# EAGLE schematic SysnapseWriless-BOB-v11g (EAGLE 5.11)
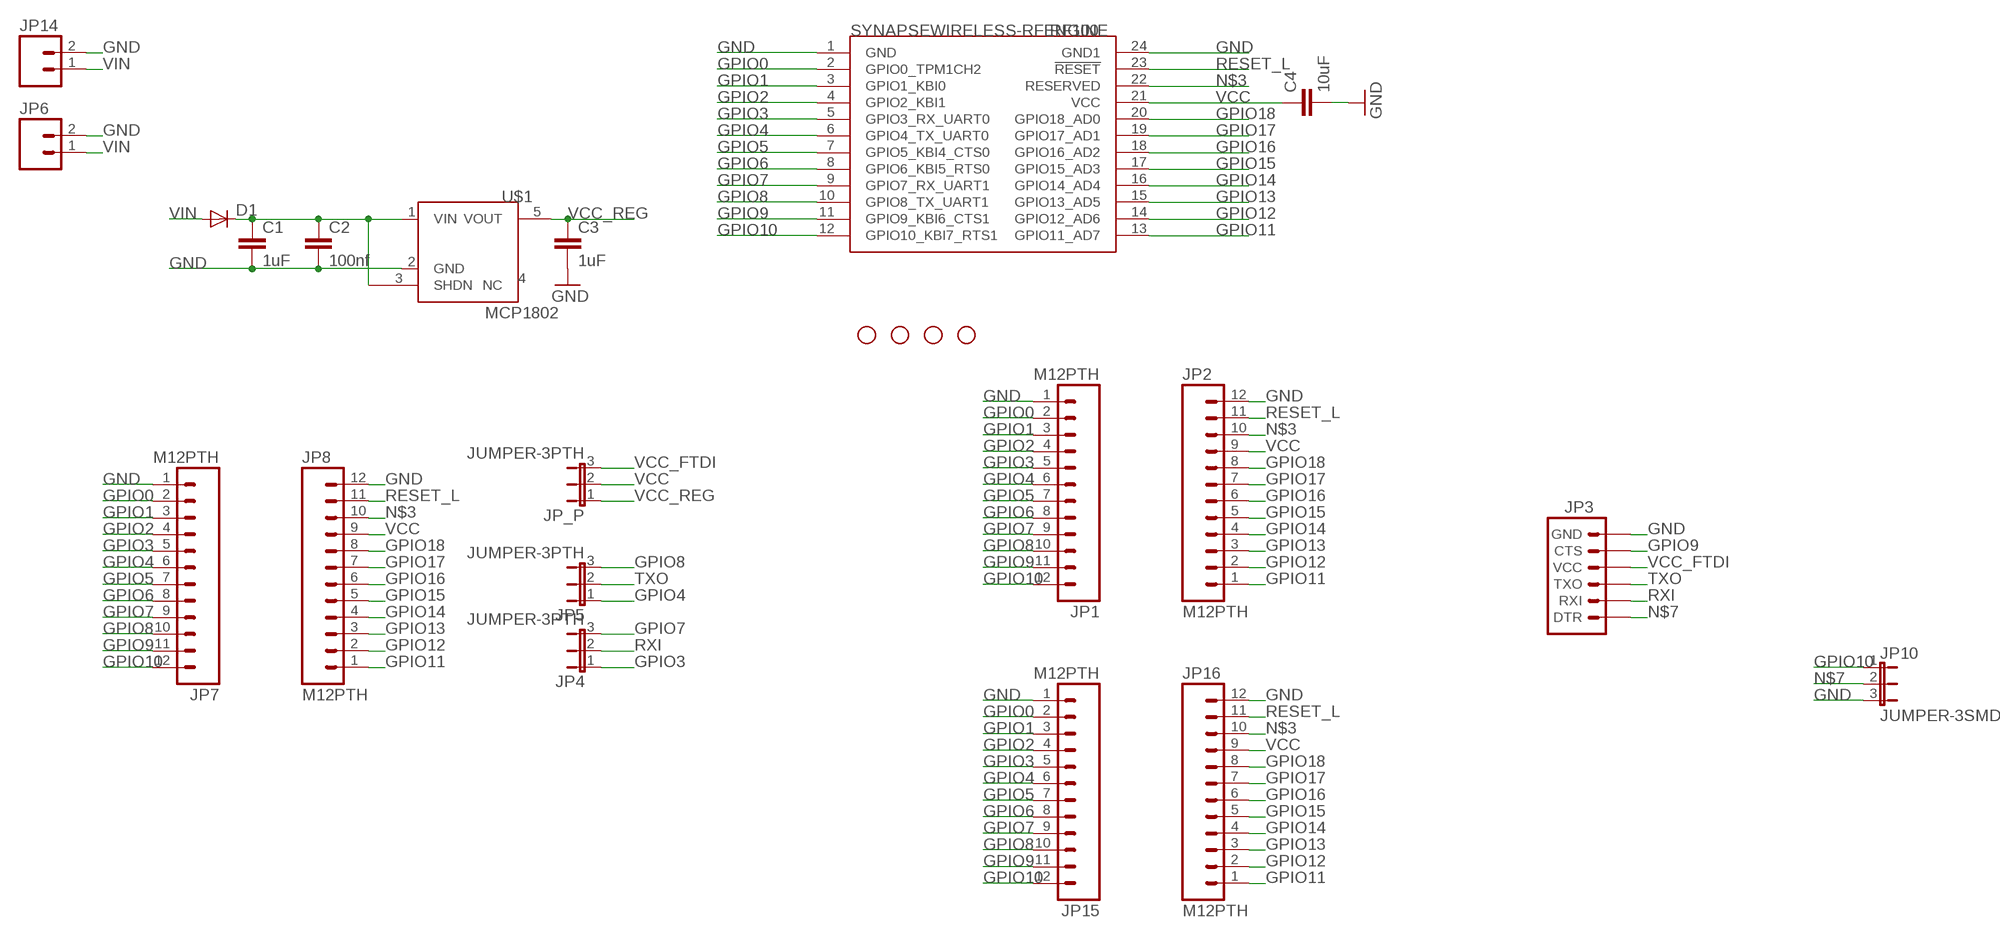
[diagram p0: schematic, sheet 1]

## Parts
C1  1uF  CAP0805  [0805]
C2  100nf  CAP0805  [0805]
C3  1uF  CAP0805  [0805]
C4  10uF  CAP0805  [0805]
D1  DIODESMA  [SMA-DIODE]
JP1  M12PTH  [1X12]
JP2  M12PTH  [1X12]
JP3  ARDUINO_SERIAL_PROGRAMPTH  [1X06]
JP4  JUMPER-3PTH  [1X03]
JP5  JUMPER-3PTH  [1X03]
JP6  M02PTH  [1X02]
JP7  M12PTH  [1X12]
JP8  M12PTH  [1X12]
JP9  STAND-OFF  [STAND-OFF]
JP10  JUMPER-3SMD  [SJ_3]
JP11  STAND-OFF  [STAND-OFF]
JP12  STAND-OFF  [STAND-OFF]
JP13  STAND-OFF  [STAND-OFF]
JP14  M023.5MM  [SCREWTERMINAL-3.5MM-2]
JP15  M12PTH  [1X12]
JP16  M12PTH  [1X12]
JP_P  JUMPER-3PTH  [1X03]
SYNAPSEWIRELESS-RFENGINE  SYNAPSEWIRELESS-RFENGINESTD  SYNAPSEWIRELESS-RFENGINETHM-SILK-TPLACE  [SYNAPSERFENGINE-THM-SILKTPLACE]
U$1  MCP1802  [SOT23-5]

## Nets
GND: C1.2 C2.2 C3.2 C4.2 JP1.1 JP2.12 JP3.6(GND) JP6.2 JP7.1 JP8.12 JP10.3 JP14.2 JP15.1 JP16.12 SYNAPSEWIRELESS-RFENGINE.1(GND) SYNAPSEWIRELESS-RFENGINE.24(GND1) U$1.2(GND)
GPIO0: JP1.2 JP7.2 JP15.2 SYNAPSEWIRELESS-RFENGINE.2(GPIO0_TPM1CH2)
GPIO1: JP1.3 JP7.3 JP15.3 SYNAPSEWIRELESS-RFENGINE.3(GPIO1_KBI0)
GPIO2: JP1.4 JP7.4 JP15.4 SYNAPSEWIRELESS-RFENGINE.4(GPIO2_KBI1)
GPIO3: JP1.5 JP4.1 JP7.5 JP15.5 SYNAPSEWIRELESS-RFENGINE.5(GPIO3_RX_UART0)
GPIO4: JP1.6 JP5.1 JP7.6 JP15.6 SYNAPSEWIRELESS-RFENGINE.6(GPIO4_TX_UART0)
GPIO5: JP1.7 JP7.7 JP15.7 SYNAPSEWIRELESS-RFENGINE.7(GPIO5_KBI4_CTS0)
GPIO6: JP1.8 JP7.8 JP15.8 SYNAPSEWIRELESS-RFENGINE.8(GPIO6_KBI5_RTS0)
GPIO7: JP1.9 JP4.3 JP7.9 JP15.9 SYNAPSEWIRELESS-RFENGINE.9(GPIO7_RX_UART1)
GPIO8: JP1.10 JP5.3 JP7.10 JP15.10 SYNAPSEWIRELESS-RFENGINE.10(GPIO8_TX_UART1)
GPIO9: JP1.11 JP3.5(CTS) JP7.11 JP15.11 SYNAPSEWIRELESS-RFENGINE.11(GPIO9_KBI6_CTS1)
GPIO10: JP1.12 JP7.12 JP10.1 JP15.12 SYNAPSEWIRELESS-RFENGINE.12(GPIO10_KBI7_RTS1)
GPIO11: JP2.1 JP8.1 JP16.1 SYNAPSEWIRELESS-RFENGINE.13(GPIO11_AD7)
GPIO12: JP2.2 JP8.2 JP16.2 SYNAPSEWIRELESS-RFENGINE.14(GPIO12_AD6)
GPIO13: JP2.3 JP8.3 JP16.3 SYNAPSEWIRELESS-RFENGINE.15(GPIO13_AD5)
GPIO14: JP2.4 JP8.4 JP16.4 SYNAPSEWIRELESS-RFENGINE.16(GPIO14_AD4)
GPIO15: JP2.5 JP8.5 JP16.5 SYNAPSEWIRELESS-RFENGINE.17(GPIO15_AD3)
GPIO16: JP2.6 JP8.6 JP16.6 SYNAPSEWIRELESS-RFENGINE.18(GPIO16_AD2)
GPIO17: JP2.7 JP8.7 JP16.7 SYNAPSEWIRELESS-RFENGINE.19(GPIO17_AD1)
GPIO18: JP2.8 JP8.8 JP16.8 SYNAPSEWIRELESS-RFENGINE.20(GPIO18_AD0)
N$1: C1.1 C2.1 D1.C U$1.1(VIN) U$1.3(SHDN)
N$3: JP2.10 JP8.10 JP16.10 SYNAPSEWIRELESS-RFENGINE.22(RESERVED)
N$7: JP3.1(DTR) JP10.2
RESET_L: JP2.11 JP8.11 JP16.11 SYNAPSEWIRELESS-RFENGINE.23(!RESET)
RXI: JP3.2(RXI) JP4.2
TXO: JP3.3(TXO) JP5.2
VCC: C4.1 JP2.9 JP8.9 JP16.9 JP_P.2 SYNAPSEWIRELESS-RFENGINE.21(VCC)
VCC_FTDI: JP3.4(VCC) JP_P.3
VCC_REG: C3.1 JP_P.1 U$1.5(VOUT)
VIN: D1.A JP6.1 JP14.1
Unconnected: U$1.4(NC)

## Library data of the parts
C1-C4 = 0_jc-custom:CAP: Capacitor Standard 0603 ceramic capacitor, and 0.1" leaded capacitor.
D1 = 0_jc-custom:DIODE: Diode These are standard reverse protection diodes and small signal diodes. SMA package can handle up to about 1A. SOD-323 can handle about 200mA. What the SOD-323 package when ordering, there are some mfgs out there that are 5-pin packages.
JP1 JP2 JP7 JP8 JP15 JP16 = SparkFun:M12: Header 12 Standard 12-pin 0.1" header. Use with straight break away headers (SKU : PRT-00116), right angle break away headers (PRT-00553), swiss pins (PRT-00743), machine pins (PRT-00117), and female headers (PRT-00115).
JP3 = SparkFun:ARDUINO_SERIAL_PROGRAM
JP4 JP5 JP10 JP_P = SparkFun:JUMPER-3
JP6 JP14 = SparkFun:M02: Header 2 Standard 2-pin 0.1" header. Use with straight break away headers (SKU : PRT-00116), right angle break away headers (PRT-00553), swiss pins (PRT-00743), machine pins (PRT-00117), and female headers (PRT-00115). Molex polarized connector foot print use with SKU : PRT-08233 with associated crimp pins and housings.
JP9 JP11-JP13 = SparkFun:STAND-OFF: Stand Off This is the mechanical footprint for a #4 phillips button head screw. Use the keepout ring to avoid running the screw head into surrounding components. SKU : PRT-00447
SYNAPSEWIRELESS-RFENGINE = 0_jc-custom:SYNAPSEWIRELESS-RFENGINE
U$1 = 0_jc-custom:MCP1802

## Net classes
0 default: width 0.254 mm